# Altium schematic sheet mantarray_beta2_sensor.SchDoc
size A1
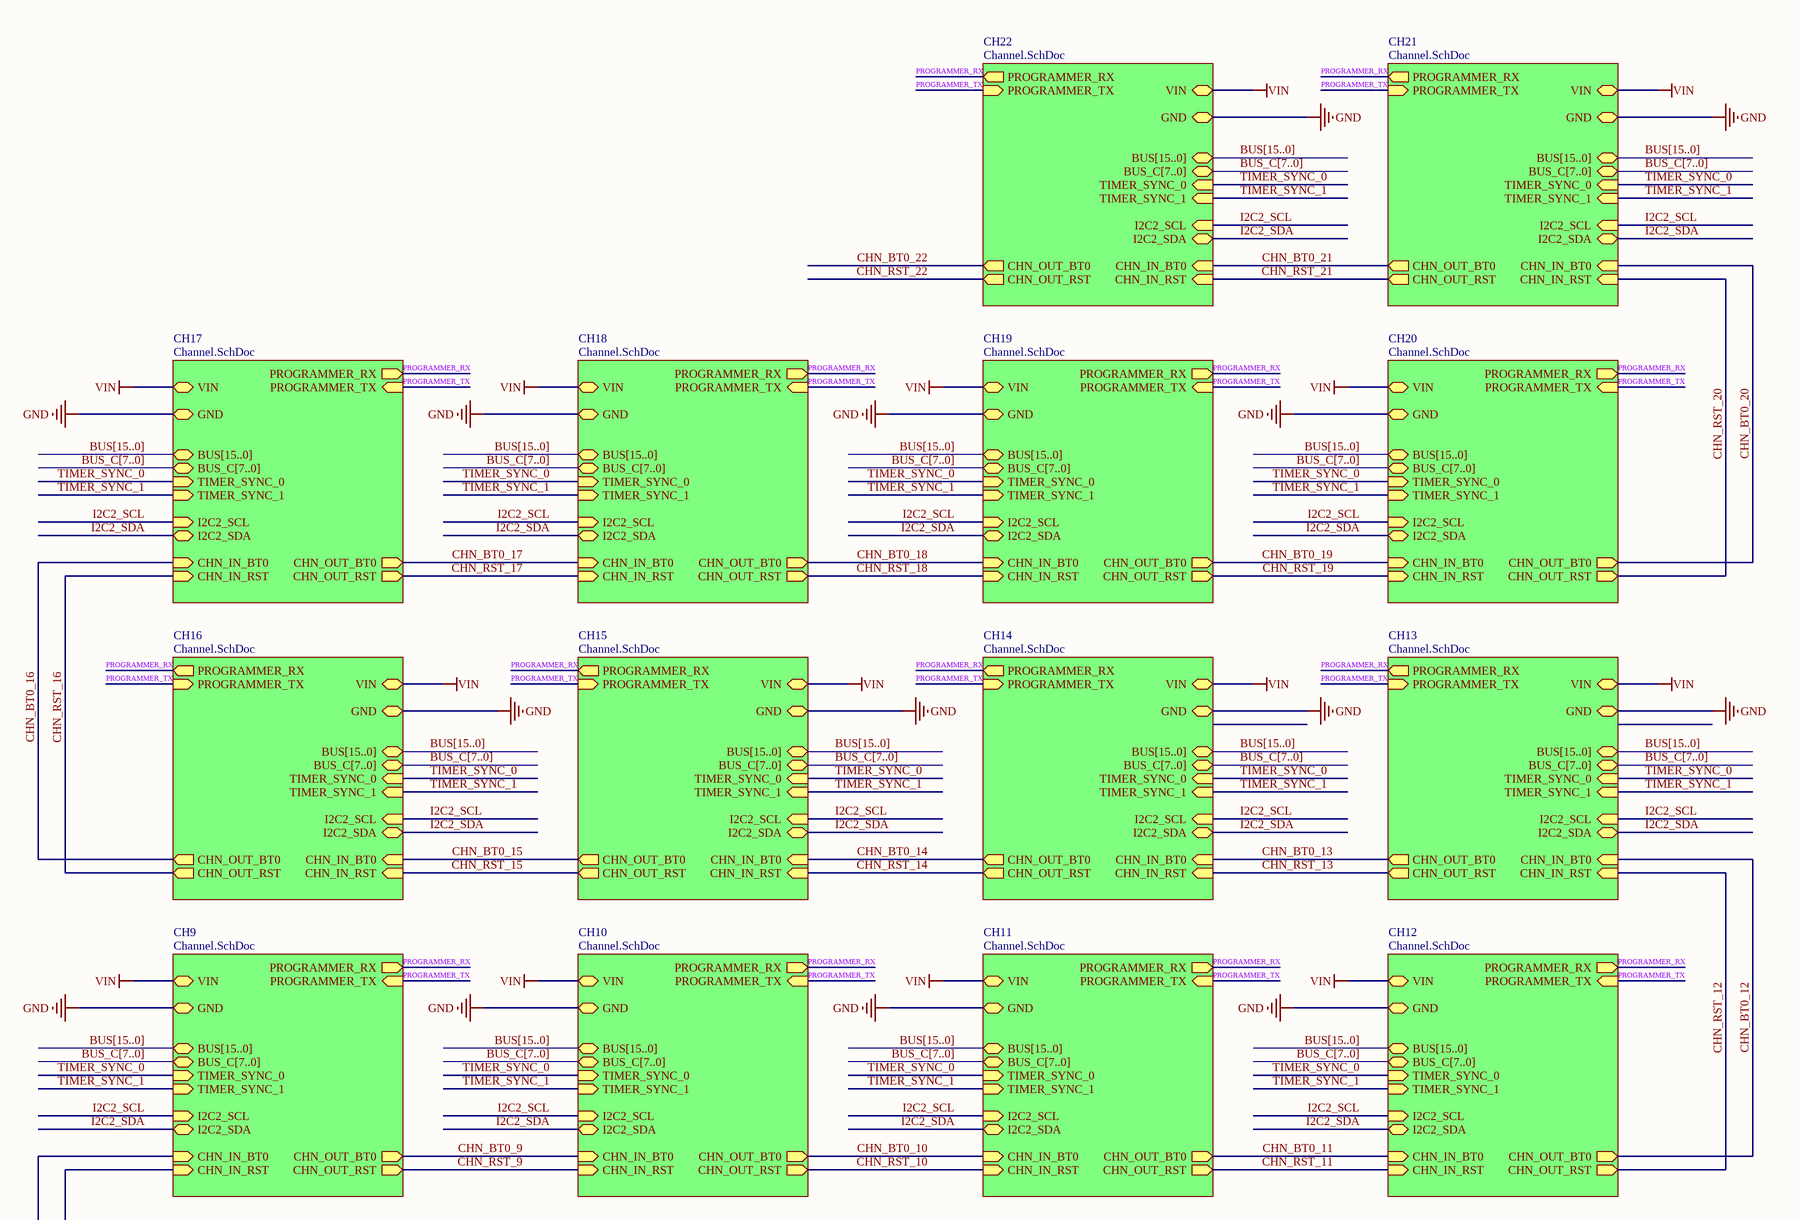
[diagram p0: mantarray_beta2_sensor.SchDoc, top right]
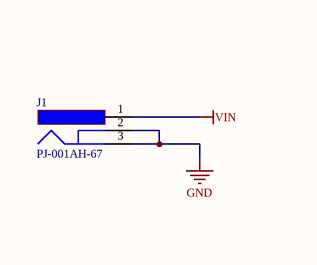
[diagram p1: mantarray_beta2_sensor.SchDoc, bottom left]
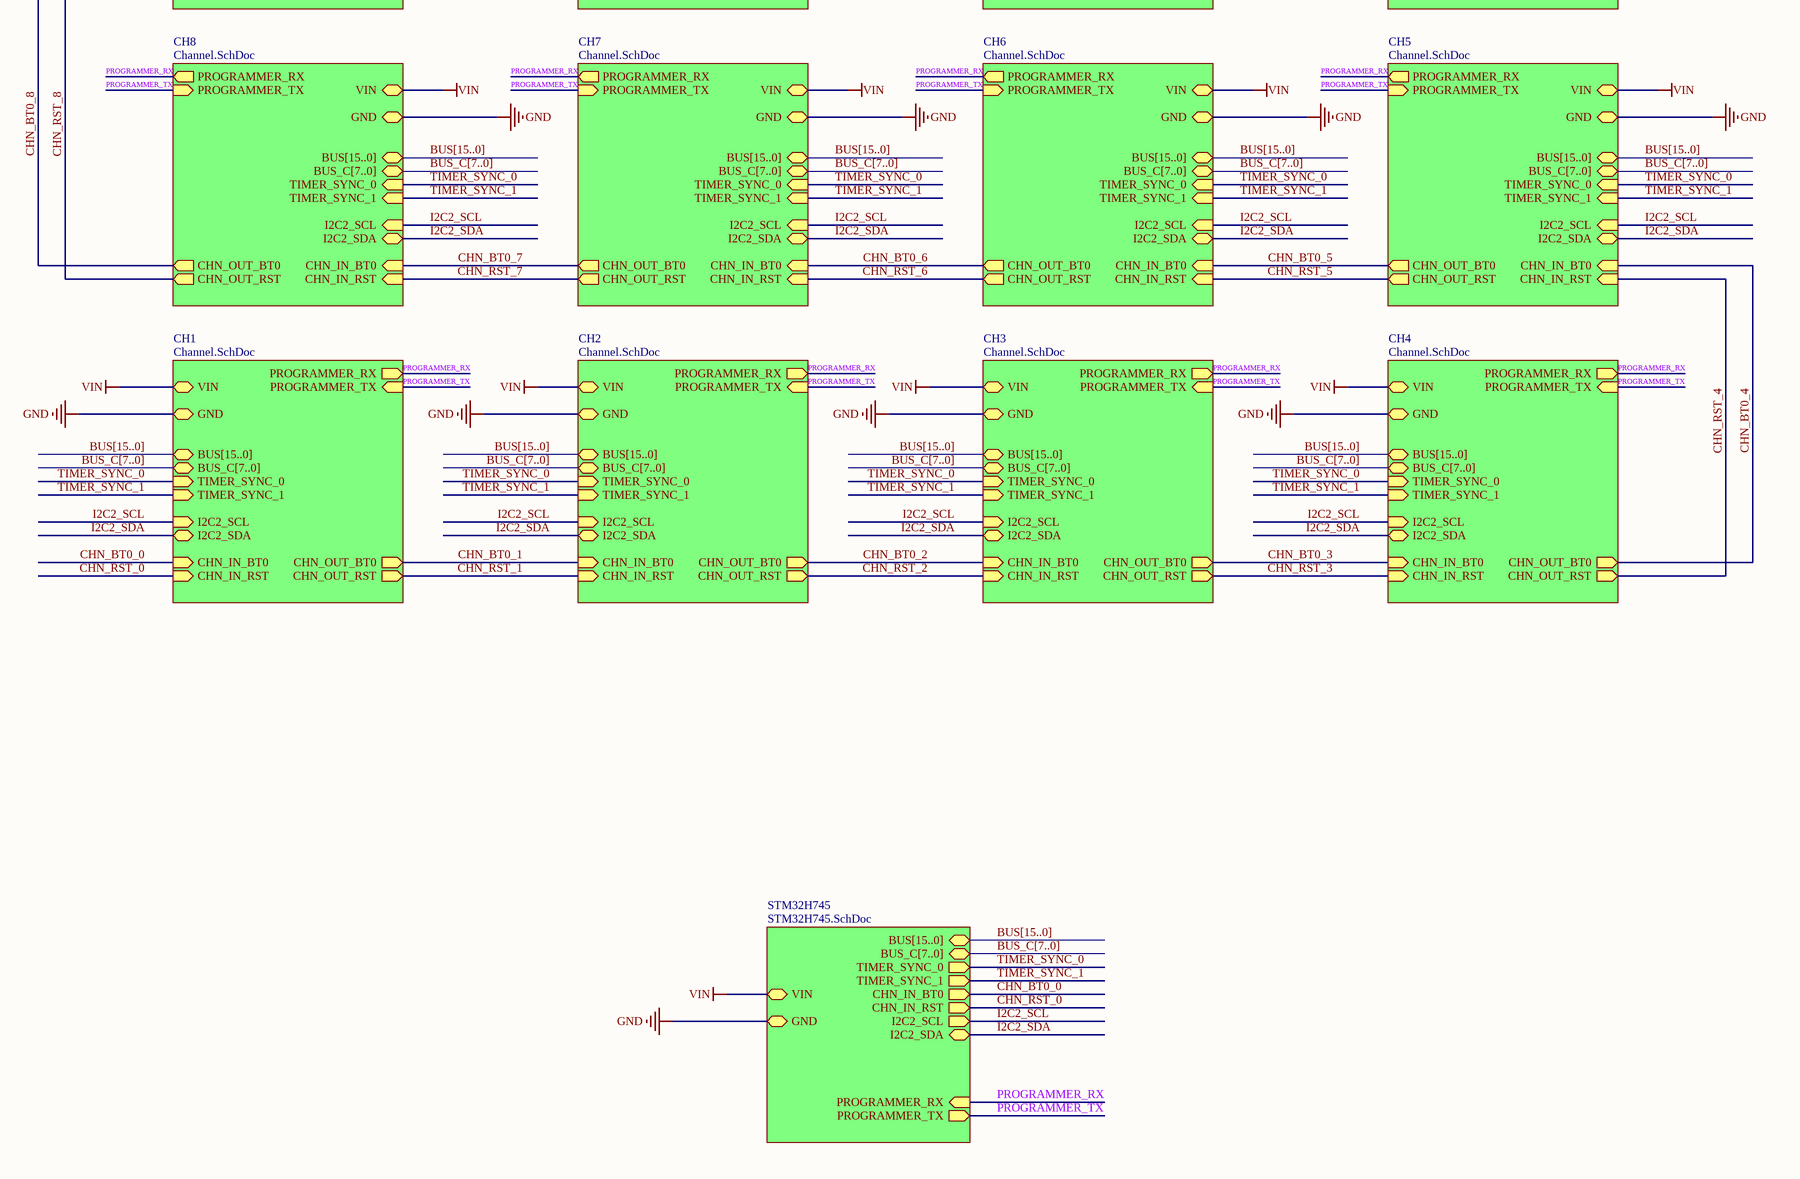
[diagram p2: mantarray_beta2_sensor.SchDoc, bottom right]

## Parts
J1  PJ-001AH-67  [PJ-001AH-67]

## Sub-sheets
CH1 = Channel.SchDoc: GND (bidir), BUS[15..0] (bidir), CHN_OUT_BT0 (out), CHN_OUT_RST (out), BUS_C[7..0] (bidir), CHN_IN_RST (in), TIMER_SYNC_0 (in), CHN_IN_BT0 (in), TIMER_SYNC_1 (in), I2C2_SCL (in), I2C2_SDA (bidir), PROGRAMMER_RX (out), PROGRAMMER_TX (in), VIN (bidir)
CH2 = Channel.SchDoc: GND (bidir), BUS[15..0] (bidir), CHN_OUT_BT0 (out), CHN_OUT_RST (out), BUS_C[7..0] (bidir), CHN_IN_RST (in), TIMER_SYNC_0 (in), CHN_IN_BT0 (in), TIMER_SYNC_1 (in), I2C2_SCL (in), I2C2_SDA (bidir), PROGRAMMER_RX (out), PROGRAMMER_TX (in), VIN (bidir)
CH3 = Channel.SchDoc: GND (bidir), BUS[15..0] (bidir), CHN_OUT_BT0 (out), CHN_OUT_RST (out), BUS_C[7..0] (bidir), CHN_IN_RST (in), TIMER_SYNC_0 (in), CHN_IN_BT0 (in), TIMER_SYNC_1 (in), I2C2_SCL (in), I2C2_SDA (bidir), PROGRAMMER_RX (out), PROGRAMMER_TX (in), VIN (bidir)
CH4 = Channel.SchDoc: GND (bidir), BUS[15..0] (bidir), CHN_OUT_BT0 (out), CHN_OUT_RST (out), BUS_C[7..0] (bidir), CHN_IN_RST (in), TIMER_SYNC_0 (in), CHN_IN_BT0 (in), TIMER_SYNC_1 (in), I2C2_SCL (in), I2C2_SDA (bidir), PROGRAMMER_RX (out), PROGRAMMER_TX (in), VIN (bidir)
CH5 = Channel.SchDoc: GND (bidir), BUS[15..0] (bidir), CHN_OUT_BT0 (out), CHN_OUT_RST (out), BUS_C[7..0] (bidir), CHN_IN_RST (in), TIMER_SYNC_0 (in), CHN_IN_BT0 (in), TIMER_SYNC_1 (in), I2C2_SCL (in), I2C2_SDA (bidir), PROGRAMMER_TX (in), PROGRAMMER_RX (out), VIN (bidir)
CH6 = Channel.SchDoc: GND (bidir), BUS[15..0] (bidir), CHN_OUT_BT0 (out), CHN_OUT_RST (out), BUS_C[7..0] (bidir), CHN_IN_RST (in), TIMER_SYNC_0 (in), CHN_IN_BT0 (in), TIMER_SYNC_1 (in), I2C2_SCL (in), I2C2_SDA (bidir), PROGRAMMER_RX (out), PROGRAMMER_TX (in), VIN (bidir)
CH7 = Channel.SchDoc: GND (bidir), BUS[15..0] (bidir), CHN_OUT_BT0 (out), CHN_OUT_RST (out), BUS_C[7..0] (bidir), CHN_IN_RST (in), TIMER_SYNC_0 (in), CHN_IN_BT0 (in), TIMER_SYNC_1 (in), I2C2_SCL (in), I2C2_SDA (bidir), PROGRAMMER_RX (out), PROGRAMMER_TX (in), VIN (bidir)
CH8 = Channel.SchDoc: GND (bidir), BUS[15..0] (bidir), CHN_OUT_BT0 (out), CHN_OUT_RST (out), BUS_C[7..0] (bidir), CHN_IN_RST (in), TIMER_SYNC_0 (in), CHN_IN_BT0 (in), TIMER_SYNC_1 (in), I2C2_SCL (in), I2C2_SDA (bidir), PROGRAMMER_RX (out), PROGRAMMER_TX (in), VIN (bidir)
CH9 = Channel.SchDoc: GND (bidir), BUS[15..0] (bidir), CHN_OUT_BT0 (out), CHN_OUT_RST (out), BUS_C[7..0] (bidir), CHN_IN_RST (in), TIMER_SYNC_0 (in), CHN_IN_BT0 (in), TIMER_SYNC_1 (in), I2C2_SCL (in), I2C2_SDA (bidir), PROGRAMMER_RX (out), PROGRAMMER_TX (in), VIN (bidir)
CH10 = Channel.SchDoc: GND (bidir), BUS[15..0] (bidir), CHN_OUT_BT0 (out), CHN_OUT_RST (out), BUS_C[7..0] (bidir), CHN_IN_RST (in), TIMER_SYNC_0 (in), CHN_IN_BT0 (in), TIMER_SYNC_1 (in), I2C2_SCL (in), I2C2_SDA (bidir), PROGRAMMER_TX (in), PROGRAMMER_RX (out), VIN (bidir)
CH11 = Channel.SchDoc: GND (bidir), BUS[15..0] (bidir), CHN_OUT_BT0 (out), CHN_OUT_RST (out), BUS_C[7..0] (bidir), CHN_IN_RST (in), TIMER_SYNC_0 (in), CHN_IN_BT0 (in), TIMER_SYNC_1 (in), I2C2_SCL (in), I2C2_SDA (bidir), PROGRAMMER_RX (out), PROGRAMMER_TX (in), VIN (bidir)
CH12 = Channel.SchDoc: GND (bidir), BUS[15..0] (bidir), CHN_OUT_BT0 (out), CHN_OUT_RST (out), BUS_C[7..0] (bidir), CHN_IN_RST (in), TIMER_SYNC_0 (in), CHN_IN_BT0 (in), TIMER_SYNC_1 (in), I2C2_SCL (in), I2C2_SDA (bidir), PROGRAMMER_TX (in), PROGRAMMER_RX (out), VIN (bidir)
CH13 = Channel.SchDoc: GND (bidir), BUS[15..0] (bidir), CHN_OUT_BT0 (out), CHN_OUT_RST (out), BUS_C[7..0] (bidir), CHN_IN_RST (in), TIMER_SYNC_0 (in), CHN_IN_BT0 (in), TIMER_SYNC_1 (in), I2C2_SCL (in), I2C2_SDA (bidir), PROGRAMMER_RX (out), PROGRAMMER_TX (in), VIN (bidir)
CH14 = Channel.SchDoc: GND (bidir), BUS[15..0] (bidir), CHN_OUT_BT0 (out), CHN_OUT_RST (out), BUS_C[7..0] (bidir), CHN_IN_RST (in), TIMER_SYNC_0 (in), CHN_IN_BT0 (in), TIMER_SYNC_1 (in), I2C2_SCL (in), I2C2_SDA (bidir), PROGRAMMER_RX (out), PROGRAMMER_TX (in), VIN (bidir)
CH15 = Channel.SchDoc: GND (bidir), BUS[15..0] (bidir), CHN_OUT_BT0 (out), CHN_OUT_RST (out), BUS_C[7..0] (bidir), CHN_IN_RST (in), TIMER_SYNC_0 (in), CHN_IN_BT0 (in), TIMER_SYNC_1 (in), I2C2_SCL (in), I2C2_SDA (bidir), PROGRAMMER_RX (out), PROGRAMMER_TX (in), VIN (bidir)
CH16 = Channel.SchDoc: GND (bidir), BUS[15..0] (bidir), CHN_OUT_BT0 (out), CHN_OUT_RST (out), BUS_C[7..0] (bidir), CHN_IN_RST (in), TIMER_SYNC_0 (in), CHN_IN_BT0 (in), TIMER_SYNC_1 (in), I2C2_SCL (in), I2C2_SDA (bidir), PROGRAMMER_TX (in), PROGRAMMER_RX (out), VIN (bidir)
CH17 = Channel.SchDoc: GND (bidir), BUS[15..0] (bidir), CHN_OUT_BT0 (out), CHN_OUT_RST (out), BUS_C[7..0] (bidir), CHN_IN_RST (in), TIMER_SYNC_0 (in), CHN_IN_BT0 (in), TIMER_SYNC_1 (in), I2C2_SCL (in), I2C2_SDA (bidir), PROGRAMMER_TX (in), PROGRAMMER_RX (out), VIN (bidir)
CH18 = Channel.SchDoc: GND (bidir), BUS[15..0] (bidir), CHN_OUT_BT0 (out), CHN_OUT_RST (out), BUS_C[7..0] (bidir), CHN_IN_RST (in), TIMER_SYNC_0 (in), CHN_IN_BT0 (in), TIMER_SYNC_1 (in), I2C2_SCL (in), I2C2_SDA (bidir), PROGRAMMER_RX (out), PROGRAMMER_TX (in), VIN (bidir)
CH19 = Channel.SchDoc: GND (bidir), BUS[15..0] (bidir), CHN_OUT_BT0 (out), CHN_OUT_RST (out), BUS_C[7..0] (bidir), CHN_IN_RST (in), TIMER_SYNC_0 (in), CHN_IN_BT0 (in), TIMER_SYNC_1 (in), I2C2_SCL (in), I2C2_SDA (bidir), PROGRAMMER_TX (in), PROGRAMMER_RX (out), VIN (bidir)
CH20 = Channel.SchDoc: GND (bidir), BUS[15..0] (bidir), CHN_OUT_BT0 (out), CHN_OUT_RST (out), BUS_C[7..0] (bidir), CHN_IN_RST (in), TIMER_SYNC_0 (in), CHN_IN_BT0 (in), TIMER_SYNC_1 (in), I2C2_SCL (in), I2C2_SDA (bidir), PROGRAMMER_RX (out), PROGRAMMER_TX (in), VIN (bidir)
CH21 = Channel.SchDoc: GND (bidir), BUS[15..0] (bidir), CHN_OUT_BT0 (out), CHN_OUT_RST (out), BUS_C[7..0] (bidir), CHN_IN_RST (in), TIMER_SYNC_0 (in), CHN_IN_BT0 (in), TIMER_SYNC_1 (in), I2C2_SCL (in), I2C2_SDA (bidir), PROGRAMMER_TX (in), PROGRAMMER_RX (out), VIN (bidir)
CH22 = Channel.SchDoc: GND (bidir), BUS[15..0] (bidir), CHN_OUT_BT0 (out), CHN_OUT_RST (out), BUS_C[7..0] (bidir), CHN_IN_RST (in), TIMER_SYNC_0 (in), CHN_IN_BT0 (in), TIMER_SYNC_1 (in), I2C2_SCL (in), I2C2_SDA (bidir), PROGRAMMER_TX (in), PROGRAMMER_RX (out), VIN (bidir)
STM32H745 = STM32H745.SchDoc: GND (bidir), VIN (bidir), BUS[15..0] (bidir), BUS_C[7..0] (bidir), TIMER_SYNC_0 (out), I2C2_SDA (bidir), I2C2_SCL (out), TIMER_SYNC_1 (out), CHN_IN_BT0 (out), CHN_IN_RST (out), PROGRAMMER_RX (in), PROGRAMMER_TX (out)

## Nets
GND: J1.2 J1.3 ; sheet STM32H745/GND, sheet CH1/GND, sheet CH2/GND, sheet CH3/GND, sheet CH4/GND, sheet CH5/GND, sheet CH6/GND, sheet CH7/GND, sheet CH8/GND, sheet CH9/GND, sheet CH10/GND, sheet CH11/GND, sheet CH12/GND, sheet CH13/GND, sheet CH14/GND, sheet CH15/GND, sheet CH16/GND, sheet CH17/GND, sheet CH18/GND, sheet CH19/GND, sheet CH20/GND, sheet CH21/GND, sheet CH22/GND
VIN: J1.1 ; sheet STM32H745/VIN, sheet CH1/VIN, sheet CH2/VIN, sheet CH3/VIN, sheet CH4/VIN, sheet CH5/VIN, sheet CH6/VIN, sheet CH7/VIN, sheet CH8/VIN, sheet CH9/VIN, sheet CH10/VIN, sheet CH11/VIN, sheet CH12/VIN, sheet CH13/VIN, sheet CH14/VIN, sheet CH15/VIN, sheet CH16/VIN, sheet CH17/VIN, sheet CH18/VIN, sheet CH19/VIN, sheet CH20/VIN, sheet CH21/VIN, sheet CH22/VIN
CHN_BT0_0: sheet STM32H745/CHN_IN_BT0, sheet CH1/CHN_IN_BT0
CHN_BT0_1: sheet CH1/CHN_OUT_BT0, sheet CH2/CHN_IN_BT0
CHN_BT0_2: sheet CH2/CHN_OUT_BT0, sheet CH3/CHN_IN_BT0
CHN_BT0_3: sheet CH3/CHN_OUT_BT0, sheet CH4/CHN_IN_BT0
CHN_BT0_4: sheet CH4/CHN_OUT_BT0, sheet CH5/CHN_IN_BT0
CHN_BT0_5: sheet CH5/CHN_OUT_BT0, sheet CH6/CHN_IN_BT0
CHN_BT0_6: sheet CH6/CHN_OUT_BT0, sheet CH7/CHN_IN_BT0
CHN_BT0_7: sheet CH7/CHN_OUT_BT0, sheet CH8/CHN_IN_BT0
CHN_BT0_8: sheet CH8/CHN_OUT_BT0, sheet CH9/CHN_IN_BT0
CHN_BT0_9: sheet CH9/CHN_OUT_BT0, sheet CH10/CHN_IN_BT0
CHN_BT0_10: sheet CH10/CHN_OUT_BT0, sheet CH11/CHN_IN_BT0
CHN_BT0_11: sheet CH11/CHN_OUT_BT0, sheet CH12/CHN_IN_BT0
CHN_BT0_12: sheet CH12/CHN_OUT_BT0, sheet CH13/CHN_IN_BT0
CHN_BT0_13: sheet CH13/CHN_OUT_BT0, sheet CH14/CHN_IN_BT0
CHN_BT0_14: sheet CH14/CHN_OUT_BT0, sheet CH15/CHN_IN_BT0
CHN_BT0_15: sheet CH15/CHN_OUT_BT0, sheet CH16/CHN_IN_BT0
CHN_BT0_16: sheet CH16/CHN_OUT_BT0, sheet CH17/CHN_IN_BT0
CHN_BT0_17: sheet CH17/CHN_OUT_BT0, sheet CH18/CHN_IN_BT0
CHN_BT0_18: sheet CH18/CHN_OUT_BT0, sheet CH19/CHN_IN_BT0
CHN_BT0_19: sheet CH19/CHN_OUT_BT0, sheet CH20/CHN_IN_BT0
CHN_BT0_20: sheet CH20/CHN_OUT_BT0, sheet CH21/CHN_IN_BT0
CHN_BT0_21: sheet CH21/CHN_OUT_BT0, sheet CH22/CHN_IN_BT0
CHN_BT0_22: sheet CH22/CHN_OUT_BT0
CHN_RST_0: sheet STM32H745/CHN_IN_RST, sheet CH1/CHN_IN_RST
CHN_RST_1: sheet CH1/CHN_OUT_RST, sheet CH2/CHN_IN_RST
CHN_RST_2: sheet CH2/CHN_OUT_RST, sheet CH3/CHN_IN_RST
CHN_RST_3: sheet CH3/CHN_OUT_RST, sheet CH4/CHN_IN_RST
CHN_RST_4: sheet CH4/CHN_OUT_RST, sheet CH5/CHN_IN_RST
CHN_RST_5: sheet CH5/CHN_OUT_RST, sheet CH6/CHN_IN_RST
CHN_RST_6: sheet CH6/CHN_OUT_RST, sheet CH7/CHN_IN_RST
CHN_RST_7: sheet CH7/CHN_OUT_RST, sheet CH8/CHN_IN_RST
CHN_RST_8: sheet CH8/CHN_OUT_RST, sheet CH9/CHN_IN_RST
CHN_RST_9: sheet CH9/CHN_OUT_RST, sheet CH10/CHN_IN_RST
CHN_RST_10: sheet CH10/CHN_OUT_RST, sheet CH11/CHN_IN_RST
CHN_RST_11: sheet CH11/CHN_OUT_RST, sheet CH12/CHN_IN_RST
CHN_RST_12: sheet CH12/CHN_OUT_RST, sheet CH13/CHN_IN_RST
CHN_RST_13: sheet CH13/CHN_OUT_RST, sheet CH14/CHN_IN_RST
CHN_RST_14: sheet CH14/CHN_OUT_RST, sheet CH15/CHN_IN_RST
CHN_RST_15: sheet CH15/CHN_OUT_RST, sheet CH16/CHN_IN_RST
CHN_RST_16: sheet CH16/CHN_OUT_RST, sheet CH17/CHN_IN_RST
CHN_RST_17: sheet CH17/CHN_OUT_RST, sheet CH18/CHN_IN_RST
CHN_RST_18: sheet CH18/CHN_OUT_RST, sheet CH19/CHN_IN_RST
CHN_RST_19: sheet CH19/CHN_OUT_RST, sheet CH20/CHN_IN_RST
CHN_RST_20: sheet CH20/CHN_OUT_RST, sheet CH21/CHN_IN_RST
CHN_RST_21: sheet CH21/CHN_OUT_RST, sheet CH22/CHN_IN_RST
CHN_RST_22: sheet CH22/CHN_OUT_RST
I2C2_SCL: sheet STM32H745/I2C2_SCL, sheet CH1/I2C2_SCL, sheet CH2/I2C2_SCL, sheet CH3/I2C2_SCL, sheet CH4/I2C2_SCL, sheet CH5/I2C2_SCL, sheet CH6/I2C2_SCL, sheet CH7/I2C2_SCL, sheet CH8/I2C2_SCL, sheet CH9/I2C2_SCL, sheet CH10/I2C2_SCL, sheet CH11/I2C2_SCL, sheet CH12/I2C2_SCL, sheet CH13/I2C2_SCL, sheet CH14/I2C2_SCL, sheet CH15/I2C2_SCL, sheet CH16/I2C2_SCL, sheet CH17/I2C2_SCL, sheet CH18/I2C2_SCL, sheet CH19/I2C2_SCL, sheet CH20/I2C2_SCL, sheet CH21/I2C2_SCL, sheet CH22/I2C2_SCL
I2C2_SDA: sheet STM32H745/I2C2_SDA, sheet CH1/I2C2_SDA, sheet CH2/I2C2_SDA, sheet CH3/I2C2_SDA, sheet CH4/I2C2_SDA, sheet CH5/I2C2_SDA, sheet CH6/I2C2_SDA, sheet CH7/I2C2_SDA, sheet CH8/I2C2_SDA, sheet CH9/I2C2_SDA, sheet CH10/I2C2_SDA, sheet CH11/I2C2_SDA, sheet CH12/I2C2_SDA, sheet CH13/I2C2_SDA, sheet CH14/I2C2_SDA, sheet CH15/I2C2_SDA, sheet CH16/I2C2_SDA, sheet CH17/I2C2_SDA, sheet CH18/I2C2_SDA, sheet CH19/I2C2_SDA, sheet CH20/I2C2_SDA, sheet CH21/I2C2_SDA, sheet CH22/I2C2_SDA
PROGRAMMER_RX: sheet STM32H745/PROGRAMMER_RX, sheet CH1/PROGRAMMER_RX, sheet CH2/PROGRAMMER_RX, sheet CH3/PROGRAMMER_RX, sheet CH4/PROGRAMMER_RX, sheet CH5/PROGRAMMER_RX, sheet CH6/PROGRAMMER_RX, sheet CH7/PROGRAMMER_RX, sheet CH8/PROGRAMMER_RX, sheet CH9/PROGRAMMER_RX, sheet CH10/PROGRAMMER_RX, sheet CH11/PROGRAMMER_RX, sheet CH12/PROGRAMMER_RX, sheet CH13/PROGRAMMER_RX, sheet CH14/PROGRAMMER_RX, sheet CH15/PROGRAMMER_RX, sheet CH16/PROGRAMMER_RX, sheet CH17/PROGRAMMER_RX, sheet CH18/PROGRAMMER_RX, sheet CH19/PROGRAMMER_RX, sheet CH20/PROGRAMMER_RX, sheet CH21/PROGRAMMER_RX, sheet CH22/PROGRAMMER_RX
PROGRAMMER_TX: sheet STM32H745/PROGRAMMER_TX, sheet CH1/PROGRAMMER_TX, sheet CH2/PROGRAMMER_TX, sheet CH3/PROGRAMMER_TX, sheet CH4/PROGRAMMER_TX, sheet CH5/PROGRAMMER_TX, sheet CH6/PROGRAMMER_TX, sheet CH7/PROGRAMMER_TX, sheet CH8/PROGRAMMER_TX, sheet CH9/PROGRAMMER_TX, sheet CH10/PROGRAMMER_TX, sheet CH11/PROGRAMMER_TX, sheet CH12/PROGRAMMER_TX, sheet CH13/PROGRAMMER_TX, sheet CH14/PROGRAMMER_TX, sheet CH15/PROGRAMMER_TX, sheet CH16/PROGRAMMER_TX, sheet CH17/PROGRAMMER_TX, sheet CH18/PROGRAMMER_TX, sheet CH19/PROGRAMMER_TX, sheet CH20/PROGRAMMER_TX, sheet CH21/PROGRAMMER_TX, sheet CH22/PROGRAMMER_TX
TIMER_SYNC_0: sheet STM32H745/TIMER_SYNC_0, sheet CH1/TIMER_SYNC_0, sheet CH2/TIMER_SYNC_0, sheet CH3/TIMER_SYNC_0, sheet CH4/TIMER_SYNC_0, sheet CH5/TIMER_SYNC_0, sheet CH6/TIMER_SYNC_0, sheet CH7/TIMER_SYNC_0, sheet CH8/TIMER_SYNC_0, sheet CH9/TIMER_SYNC_0, sheet CH10/TIMER_SYNC_0, sheet CH11/TIMER_SYNC_0, sheet CH12/TIMER_SYNC_0, sheet CH13/TIMER_SYNC_0, sheet CH14/TIMER_SYNC_0, sheet CH15/TIMER_SYNC_0, sheet CH16/TIMER_SYNC_0, sheet CH17/TIMER_SYNC_0, sheet CH18/TIMER_SYNC_0, sheet CH19/TIMER_SYNC_0, sheet CH20/TIMER_SYNC_0, sheet CH21/TIMER_SYNC_0, sheet CH22/TIMER_SYNC_0
TIMER_SYNC_1: sheet STM32H745/TIMER_SYNC_1, sheet CH1/TIMER_SYNC_1, sheet CH2/TIMER_SYNC_1, sheet CH3/TIMER_SYNC_1, sheet CH4/TIMER_SYNC_1, sheet CH5/TIMER_SYNC_1, sheet CH6/TIMER_SYNC_1, sheet CH7/TIMER_SYNC_1, sheet CH8/TIMER_SYNC_1, sheet CH9/TIMER_SYNC_1, sheet CH10/TIMER_SYNC_1, sheet CH11/TIMER_SYNC_1, sheet CH12/TIMER_SYNC_1, sheet CH13/TIMER_SYNC_1, sheet CH14/TIMER_SYNC_1, sheet CH15/TIMER_SYNC_1, sheet CH16/TIMER_SYNC_1, sheet CH17/TIMER_SYNC_1, sheet CH18/TIMER_SYNC_1, sheet CH19/TIMER_SYNC_1, sheet CH20/TIMER_SYNC_1, sheet CH21/TIMER_SYNC_1, sheet CH22/TIMER_SYNC_1

## Buses and harness runs
bus BUS[15..0] = sheet CH1/BUS[15..0]
bus BUS[15..0] = sheet CH2/BUS[15..0]
bus BUS[15..0] = sheet CH3/BUS[15..0]
bus BUS[15..0] = sheet CH4/BUS[15..0]
bus BUS[15..0] = sheet CH5/BUS[15..0]
bus BUS[15..0] = sheet CH6/BUS[15..0]
bus BUS[15..0] = sheet CH7/BUS[15..0]
bus BUS[15..0] = sheet CH8/BUS[15..0]
bus BUS[15..0] = sheet CH9/BUS[15..0]
bus BUS[15..0] = sheet CH10/BUS[15..0]
bus BUS[15..0] = sheet CH11/BUS[15..0]
bus BUS[15..0] = sheet CH12/BUS[15..0]
bus BUS[15..0] = sheet CH13/BUS[15..0]
bus BUS[15..0] = sheet CH14/BUS[15..0]
bus BUS[15..0] = sheet CH15/BUS[15..0]
bus BUS[15..0] = sheet CH16/BUS[15..0]
bus BUS[15..0] = sheet CH17/BUS[15..0]
bus BUS[15..0] = sheet CH18/BUS[15..0]
bus BUS[15..0] = sheet CH19/BUS[15..0]
bus BUS[15..0] = sheet CH20/BUS[15..0]
bus BUS[15..0] = sheet CH21/BUS[15..0]
bus BUS[15..0] = sheet CH22/BUS[15..0]
bus BUS[15..0] = sheet STM32H745/BUS[15..0]
bus BUS_C[7..0] = sheet CH1/BUS_C[7..0]
bus BUS_C[7..0] = sheet CH2/BUS_C[7..0]
bus BUS_C[7..0] = sheet CH3/BUS_C[7..0]
bus BUS_C[7..0] = sheet CH4/BUS_C[7..0]
bus BUS_C[7..0] = sheet CH5/BUS_C[7..0]
bus BUS_C[7..0] = sheet CH6/BUS_C[7..0]
bus BUS_C[7..0] = sheet CH7/BUS_C[7..0]
bus BUS_C[7..0] = sheet CH8/BUS_C[7..0]
bus BUS_C[7..0] = sheet CH9/BUS_C[7..0]
bus BUS_C[7..0] = sheet CH10/BUS_C[7..0]
bus BUS_C[7..0] = sheet CH11/BUS_C[7..0]
bus BUS_C[7..0] = sheet CH12/BUS_C[7..0]
bus BUS_C[7..0] = sheet CH13/BUS_C[7..0]
bus BUS_C[7..0] = sheet CH14/BUS_C[7..0]
bus BUS_C[7..0] = sheet CH15/BUS_C[7..0]
bus BUS_C[7..0] = sheet CH16/BUS_C[7..0]
bus BUS_C[7..0] = sheet CH17/BUS_C[7..0]
bus BUS_C[7..0] = sheet CH18/BUS_C[7..0]
bus BUS_C[7..0] = sheet CH19/BUS_C[7..0]
bus BUS_C[7..0] = sheet CH20/BUS_C[7..0]
bus BUS_C[7..0] = sheet CH21/BUS_C[7..0]
bus BUS_C[7..0] = sheet CH22/BUS_C[7..0]
bus BUS_C[7..0] = sheet STM32H745/BUS_C[7..0]

## Notes on the sheet
- Title
- Size:
- Date:
- File:
- A1
- Number:
- Time:
- Revision:
- Sheet
- of

## Library data of the parts
J1 = PJ-001AH-67: IP67 waterproof DC Power Jack; Digikey: https://www.digikey.com/en/products/detail/cui-devices/PJ-001AH-67/9866231?s=N4IgTCBcDaIAoCkC0AGFBGAggCSQNgHYQBdAXyA